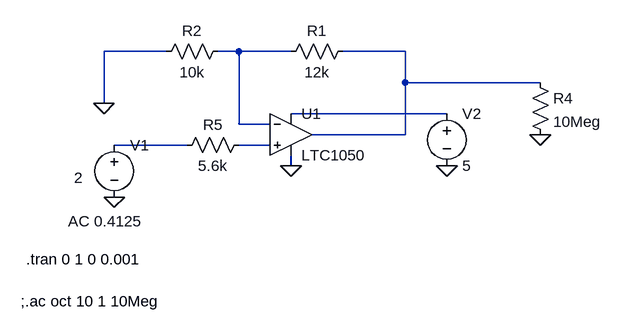
[diagram p0: schematic ibat-amplifier.asc]
ibat-amplifier.asc, the LTspice schematic file:
Version 4
SHEET 1 1392 680
WIRE 208 -192 112 -192
WIRE 320 -192 288 -192
WIRE 400 -192 320 -192
WIRE 576 -192 480 -192
WIRE 576 -144 576 -192
WIRE 784 -144 576 -144
WIRE 112 -112 112 -192
WIRE 640 -96 400 -96
WIRE 320 -80 320 -192
WIRE 368 -80 320 -80
WIRE 576 -64 576 -144
WIRE 576 -64 432 -64
WIRE 240 -48 128 -48
WIRE 368 -48 320 -48
WIRE 400 -16 400 -32
FLAG 128 32 0
FLAG 784 -64 0
FLAG 640 -16 0
FLAG 400 -16 0
FLAG 112 -112 0
SYMBOL voltage 128 -64 R0
WINDOW 3 -62 66 Left 2
WINDOW 123 -71 133 Left 2
WINDOW 39 0 0 Left 2
SYMATTR Value 2
SYMATTR Value2 AC 0.4125
SYMATTR InstName V1
SYMBOL voltage 640 -112 R0
WINDOW 123 0 0 Left 2
WINDOW 39 0 0 Left 2
SYMATTR InstName V2
SYMATTR Value 5
SYMBOL res 496 -208 R90
WINDOW 0 0 56 VBottom 2
WINDOW 3 32 56 VTop 2
SYMATTR InstName R1
SYMATTR Value 12k
SYMBOL res 304 -208 R90
WINDOW 0 0 56 VBottom 2
WINDOW 3 32 56 VTop 2
SYMATTR InstName R2
SYMATTR Value 10k
SYMBOL res 768 -160 R0
SYMATTR InstName R4
SYMATTR Value 10Meg
SYMBOL res 336 -64 R90
WINDOW 0 0 56 VBottom 2
WINDOW 3 32 56 VTop 2
SYMATTR InstName R5
SYMATTR Value 5.6k
SYMBOL Opamps\\LTC1050 400 -128 R0
SYMATTR InstName U1
TEXT -16 192 Left 2 !;.ac oct 10 1 10Meg
TEXT -8 128 Left 2 !.tran 0 1 0 0.001

The netlist it stands for:
* ibat-amplifier.asc
V1 N004 0 2 AC 0.4125
V2 N003 0 5
R1 N002 N001 12k
R2 N001 0 10k
R4 N002 0 10Meg
R5 N005 N004 5.6k
XU1 N005 N001 N003 0 N002 LTC1050  ; pins In+ In- V+ V- OUT
;.ac oct 10 1 10Meg
.tran 0 1 0 0.001
.lib LTC.lib
.backanno
.end